# Altium schematic sheet 3.3 Voltage Regulator.SchDoc
size A4
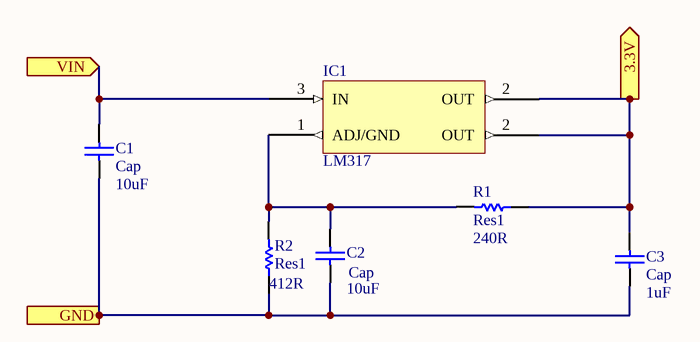
[diagram p0: 3.3 Voltage Regulator.SchDoc]

## Parts
C1  Cap  value 10uF  [RAD-0.3]
C2  Cap  value 10uF  [RAD-0.3]
C3  Cap  value 1uF  [RAD-0.3]
IC1  LM317  [SOT-223]
R1  Res1  value 240R  [AXIAL-0.3]
R2  Res1  value 412R  [AXIAL-0.3]

## Ports
3.3V (out), GND (out), VIN (in)

## Nets
3.3V: C3.2 IC1.2(OUT) R1.1 ; port 3.3V
GND: C1.1 C2.1 C3.1 R2.1 ; port GND
VIN: C1.2 IC1.3(IN) ; port VIN
NetC2_2: C2.2 IC1.1(ADJ/GND) R1.2 R2.2

## Library data of the parts
C1-C3 = Cap: Capacitor; Published: 8-Jun-2000; LatestRevisionDate: 17-Jul-2002; LatestRevisionNote: Re-released for DXP Platform.; PackageReference: RAD-0.3; Publisher: Altium Limited; PackageDescription: Radial Cap, Thru-Hole; 2 Leads; 0.3 in Pin Spacing
R1 R2 = Res1: Resistor; Published: 8-Jun-2000; LatestRevisionDate: 17-Jul-2002; LatestRevisionNote: Re-released for DXP Platform.; PackageReference: AXIAL-0.3; Publisher: Altium Limited; PackageDescription: Axial Device, Thru-Hole; 2 Leads; 0.3 in Pin Spacing